# Altium project projekt.PrjPCB
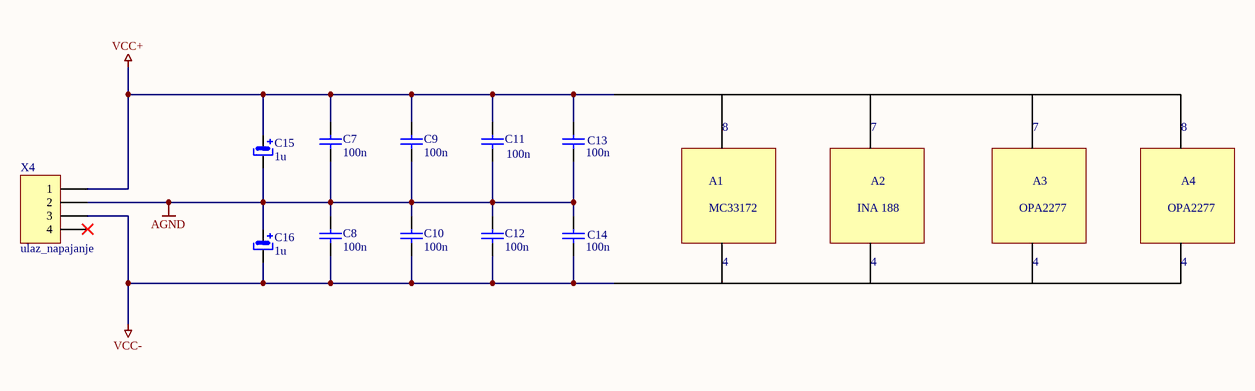
[diagram p0: napajanje.SchDoc]
2 sheets, 45 parts. Net scope: global (net labels, ports and power ports of the same name join across sheets).
Board files: PCB6.PcbDoc, PCB10.PcbDoc
Sheets:
  napajanje.SchDoc
  shema_projekt kor4.SchDoc

## Sheet napajanje.SchDoc
size A4

### Parts
C7  100n  [C0805]
C8  100n  [C0805]
C9  100n  [C0805]
C10  100n  [C0805]
C11  100n  [C0805]
C12  100n  [C0805]
C13  100n  [C0805]
C14  100n  [C0805]
C15  1u  [6-0805_M]
C16  1u  [6-0805_M]
X4  ulaz_napajanje  [HDR1X4]

### Nets
AGND: C7.1 C8.2 C9.1 C10.2 C11.1 C12.2 C13.1 C14.2 C15.2 C16.1 X4.2
VCC+: C7.2 C9.2 C11.2 C13.2 C15.1 X4.1
VCC-: C8.1 C10.1 C12.1 C14.1 C16.2 X4.3

Not connected (* = marked no-connect by the designer): X4 4*

### Notes on the sheet
- 8
- 7
- A1
- MC33172
- INA 188
- A2
- OPA2277
- A3
- A4
- 4

### Library data of the parts
C7-C14 = Cap: Capacitor; Value: 100pF; cijena [£]: 0.146; Kat.broj: 1301717; Published: 8-Jun-2000; LatestRevisionDate: 17-Jul-2002; LatestRevisionNote: Re-released for DXP Platform.; PackageReference: RAD-0.3; Publisher: Altium Limited; PackageDescription: Radial Cap, Thru-Hole; 2 Leads; 0.3 in Pin Spacing
C15 C16 = elko: cijena [£]: 0.521; Kat.broj: 1658221
X4 = Header 4H: Header, 4-Pin, Right Angle; cijena [£]: 1.38; Kat.broj: 2554950; LatestRevisionDate: 17-Jul-2002; LatestRevisionNote: Re-released for DXP Platform.; Publisher: Altium Limited

## Sheet shema_projekt kor4.SchDoc
size A4
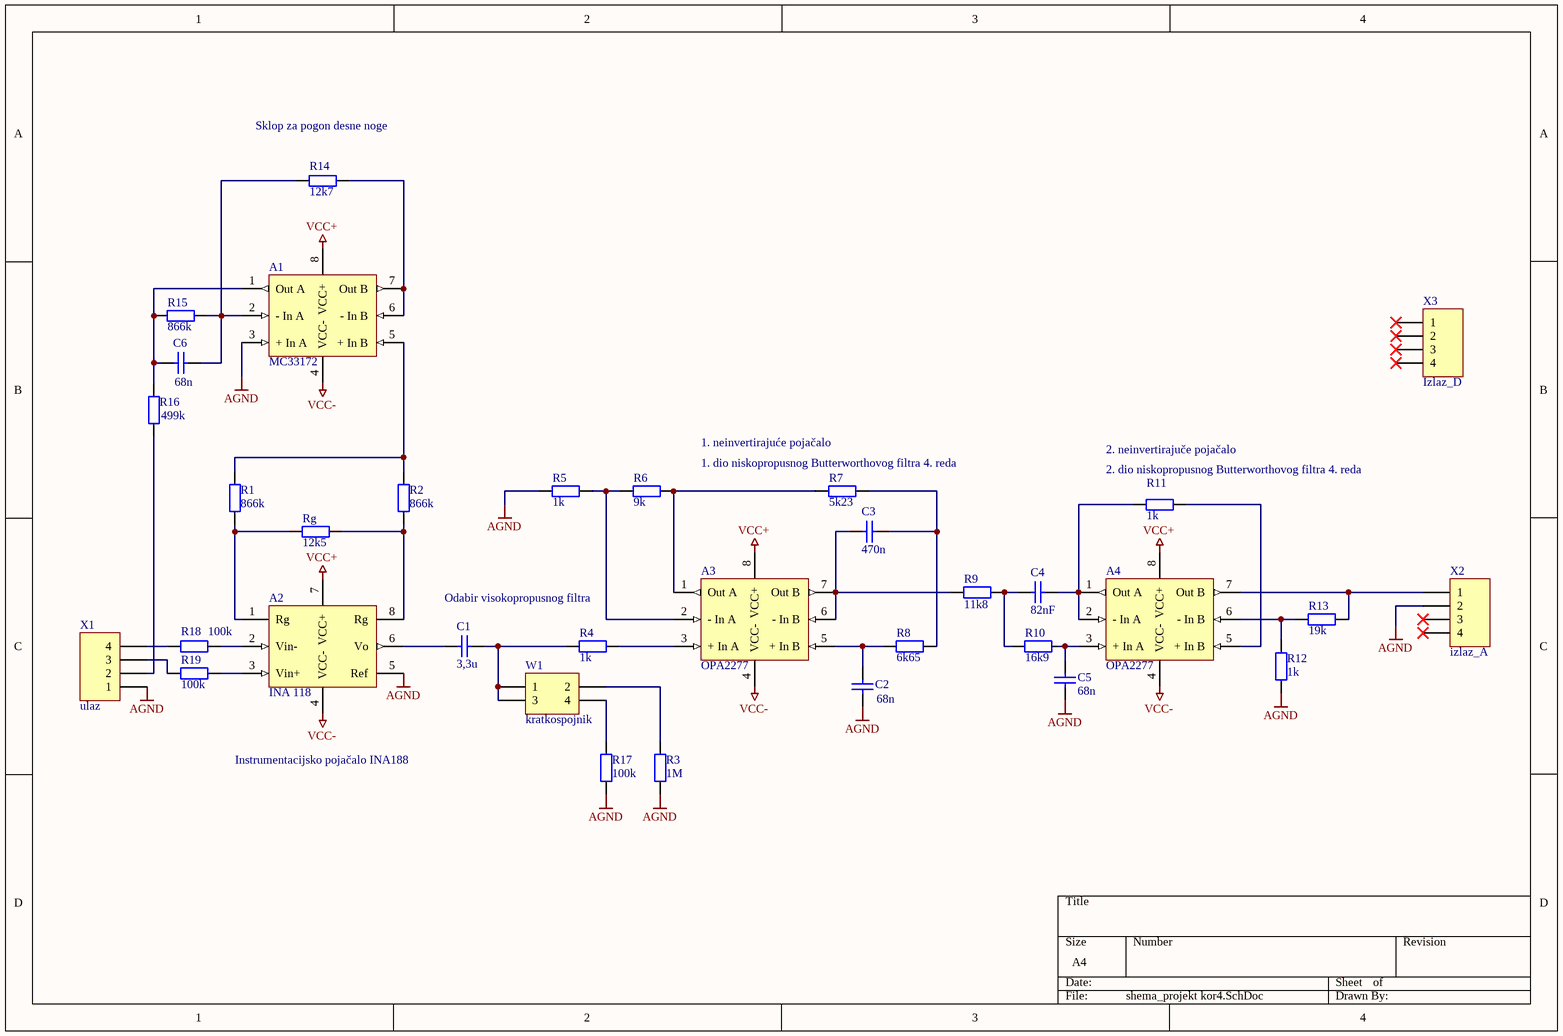
[diagram p1: shema_projekt kor4.SchDoc]

### Parts
A1  MC33172  [SOIC127P600X175-8N]
A2  INA 118  [SOIC127P600X175-8N]
A3  OPA2277  [SOIC127P600X175-8N]
A4  OPA2277  [SOIC127P600X175-8N]
C1  3,3u  [C0805]
C2  68n  [C0805]
C3  470n  [C0805]
C4  82nF  [C0805]
C5  68n  [C0805]
C6  68n  [C0805]
R1  866k  [C0805]
R2  866k  [C0805]
R3  1M  [C0805]
R4  1k  [C0805]
R5  1k  [C0805]
R6  9k  [C0805]
R7  5k23  [C0805]
R8  6k65  [C0805]
R9  11k8  [C0805]
R10  16k9  [C0805]
R11  1k  [C0805]
R12  1k  [C0805]
R13  19k  [C0805]
R14  12k7  [C0805]
R15  866k  [C0805]
R16  499k  [C0805]
R17  100k  [C0805]
R18  100k  [C0805]
R19  100k  [C0805]
Rg  12k5  [C0805]
W1  kratkospojnik  [HDR2X2]
X1  ulaz  [HDR1X4]
X2  izlaz_A  [HDR1X4]
X3  Izlaz_D  [HDR1X4]

### Nets
AGND: A1.3(+_In_A) A2.5(Ref) C2.2 C5.2 R3.2 R5.1 R12.2 R17.2 X1.1 X2.2
VCC+: A1.8(VCC+) A2.7(VCC+) A3.8(VCC+) A4.8(VCC+)
VCC-: A1.4(VCC-) A2.4(VCC-) A3.4(VCC-) A4.4(VCC-)
NetA1_1: A1.1(Out_A) C6.1 R15.1 R16.1
NetA1_2: A1.2(-_In_A) C6.2 R14.1 R15.2
NetA1_5: A1.5(+_In_B) R1.1 R2.2
NetA1_6: A1.6(-_In_B) A1.7(Out_B) R14.2
NetA2_1: A2.1(Rg) R1.2 Rg.1
NetA2_2: A2.2(Vin-) R18.1
NetA2_3: A2.3(Vin+) R19.2
NetA2_6: A2.6(Vo) C1.1
NetA2_8: A2.8(Rg) R2.1 Rg.2
NetA3_1: A3.1(Out_A) R6.2 R7.1
NetA3_2: A3.2(-_In_A) R5.2 R6.1
NetA3_3: A3.3(+_In_A) R4.2
NetA3_5: A3.5(+_In_B) C2.1 R8.1
NetA3_6: A3.6(-_In_B) A3.7(Out_B) C3.1 R9.2
NetA4_1: A4.1(Out_A) A4.2(-_In_A) C4.2 R11.1
NetA4_3: A4.3(+_In_A) C5.1 R10.2
NetA4_5: A4.5(+_In_B) R11.2
NetA4_6: A4.6(-_In_B) R12.1 R13.1
NetA4_7: A4.7(Out_B) R13.2 X2.1
NetC1_2: C1.2 R4.1 W1.1 W1.3
NetC3_2: C3.2 R7.2 R8.2
NetC4_1: C4.1 R9.1 R10.1
NetR3_1: R3.1 W1.2
NetR16_2: R16.2 X1.2
NetR17_1: R17.1 W1.4
NetR18_2: R18.2 X1.4
NetR19_1: R19.1 X1.3

Not connected (* = marked no-connect by the designer): X2 3* 4*; X3 1* 2* 3* 4*

### Notes on the sheet
- (near R14) Sklop za pogon desne noge
- 1. neinvertirajuće pojačalo
- (near R7) 1. dio niskopropusnog Butterworthovog filtra 4. reda
- (near R11) 2. neinvertirajuče pojačalo
- (near R11) 2. dio niskopropusnog Butterworthovog filtra 4. reda
- Odabir visokopropusnog filtra
- Instrumentacijsko pojačalo INA188

### Library data of the parts
A1 = OPA2333: cijena [£]: 0.864; Kat.broj: 2844927
A2 = INA 333: cijena [£]: 3.64; Kat.broj: 2507235
A3 A4 = OPA2277: cijena [£]: 3.69; Kat.broj: 1234768
C1 = Cap: Capacitor; Value: 100pF; cijena [£]: 0.308; Kat.broj: 1759412; Published: 8-Jun-2000; LatestRevisionDate: 17-Jul-2002; LatestRevisionNote: Re-released for DXP Platform.; PackageReference: RAD-0.3; Publisher: Altium Limited; PackageDescription: Radial Cap, Thru-Hole; 2 Leads; 0.3 in Pin Spacing
C2 C5 C6 = Cap: Capacitor; Value: 100pF; cijena [£]: 0.0442; Kat.broj: 1759262; Published: 8-Jun-2000; LatestRevisionDate: 17-Jul-2002; LatestRevisionNote: Re-released for DXP Platform.; PackageReference: RAD-0.3; Publisher: Altium Limited; PackageDescription: Radial Cap, Thru-Hole; 2 Leads; 0.3 in Pin Spacing
C3 = Cap: Capacitor; Value: 100pF; cijena [£]: 0.112; Kat.broj: 1759148; Published: 8-Jun-2000; LatestRevisionDate: 17-Jul-2002; LatestRevisionNote: Re-released for DXP Platform.; PackageReference: RAD-0.3; Publisher: Altium Limited; PackageDescription: Radial Cap, Thru-Hole; 2 Leads; 0.3 in Pin Spacing
C4 = Cap: Capacitor; Value: 100pF; cijena [£]: 0.0651; Kat.broj: 1759264; Published: 8-Jun-2000; LatestRevisionDate: 17-Jul-2002; LatestRevisionNote: Re-released for DXP Platform.; PackageReference: RAD-0.3; Publisher: Altium Limited; PackageDescription: Radial Cap, Thru-Hole; 2 Leads; 0.3 in Pin Spacing
R1 R2 R15 = Res2: Resistor; Value: 1K; cijena [£]: 0.0081; Kat.broj: 2447731; Published: 8-Jun-2000; LatestRevisionDate: 17-Jul-2002; LatestRevisionNote: Re-released for DXP Platform.; PackageReference: AXIAL-0.4; Publisher: Altium Limited; PackageDescription: Axial Device, Thru-Hole; 2 Leads; 0.4 in Pin Spacing
R3 = Res2: Resistor; Value: 1K; cijena [£]: 0.034; Kat.broj: 1576507; Published: 8-Jun-2000; LatestRevisionDate: 17-Jul-2002; LatestRevisionNote: Re-released for DXP Platform.; PackageReference: AXIAL-0.4; Publisher: Altium Limited; PackageDescription: Axial Device, Thru-Hole; 2 Leads; 0.4 in Pin Spacing
R4 R5 R11 R12 = Res2: Resistor; cijena [£]: 0.0046; Kat.broj: 2688819; Published: 8-Jun-2000; LatestRevisionDate: 17-Jul-2002; LatestRevisionNote: Re-released for DXP Platform.; PackageReference: AXIAL-0.4; Publisher: Altium Limited; PackageDescription: Axial Device, Thru-Hole; 2 Leads; 0.4 in Pin Spacing; Value: 1K
R6 = Res2: Resistor; Value: 1K; cijena [£]: 0.36; Kat.broj: 1160198; Published: 8-Jun-2000; LatestRevisionDate: 17-Jul-2002; LatestRevisionNote: Re-released for DXP Platform.; PackageReference: AXIAL-0.4; Publisher: Altium Limited; PackageDescription: Axial Device, Thru-Hole; 2 Leads; 0.4 in Pin Spacing
R7 = Res2: Resistor; Value: 1K; cijena [£]: 0.0718; Kat.broj: 2312278; Published: 8-Jun-2000; LatestRevisionDate: 17-Jul-2002; LatestRevisionNote: Re-released for DXP Platform.; PackageReference: AXIAL-0.4; Publisher: Altium Limited; PackageDescription: Axial Device, Thru-Hole; 2 Leads; 0.4 in Pin Spacing
R8 = Res2: Resistor; Value: 1K; cijena [£]: 0.0349; Kat.broj: 2138965; Published: 8-Jun-2000; LatestRevisionDate: 17-Jul-2002; LatestRevisionNote: Re-released for DXP Platform.; PackageReference: AXIAL-0.4; Publisher: Altium Limited; PackageDescription: Axial Device, Thru-Hole; 2 Leads; 0.4 in Pin Spacing
R9 = Res2: Resistor; Value: 1K; cijena [£]: 0.0268; Kat.broj: 2138981; Published: 8-Jun-2000; LatestRevisionDate: 17-Jul-2002; LatestRevisionNote: Re-released for DXP Platform.; PackageReference: AXIAL-0.4; Publisher: Altium Limited; PackageDescription: Axial Device, Thru-Hole; 2 Leads; 0.4 in Pin Spacing
R10 = Res2: Resistor; Value: 1K; cijena [£]: 0.026; Kat.broj: 1652926; Published: 8-Jun-2000; LatestRevisionDate: 17-Jul-2002; LatestRevisionNote: Re-released for DXP Platform.; PackageReference: AXIAL-0.4; Publisher: Altium Limited; PackageDescription: Axial Device, Thru-Hole; 2 Leads; 0.4 in Pin Spacing
R13 = Res2: Resistor; Value: 1K; cijena [£]: 0.026; Kat.broj: 1692532; Published: 8-Jun-2000; LatestRevisionDate: 17-Jul-2002; LatestRevisionNote: Re-released for DXP Platform.; PackageReference: AXIAL-0.4; Publisher: Altium Limited; PackageDescription: Axial Device, Thru-Hole; 2 Leads; 0.4 in Pin Spacing
R14 = Res2: Resistor; Value: 1K; cijena [£]: 0.026; Kat.broj: 1469868; Published: 8-Jun-2000; LatestRevisionDate: 17-Jul-2002; LatestRevisionNote: Re-released for DXP Platform.; PackageReference: AXIAL-0.4; Publisher: Altium Limited; PackageDescription: Axial Device, Thru-Hole; 2 Leads; 0.4 in Pin Spacing
R16 = Res2: Resistor; Value: 1K; cijena [£]: 0.0264; Kat.broj: 1653008; Published: 8-Jun-2000; LatestRevisionDate: 17-Jul-2002; LatestRevisionNote: Re-released for DXP Platform.; PackageReference: AXIAL-0.4; Publisher: Altium Limited; PackageDescription: Axial Device, Thru-Hole; 2 Leads; 0.4 in Pin Spacing
R17 = Res2: Resistor; Value: 1K; cijena [£]: 0.0015; Kat.broj: 2446868; Published: 8-Jun-2000; LatestRevisionDate: 17-Jul-2002; LatestRevisionNote: Re-released for DXP Platform.; PackageReference: AXIAL-0.4; Publisher: Altium Limited; PackageDescription: Axial Device, Thru-Hole; 2 Leads; 0.4 in Pin Spacing
R18 R19 = Res2: Resistor; Value: 1K; cijena [£]: 0.0264; Kat.broj: 1469860RL; Published: 8-Jun-2000; LatestRevisionDate: 17-Jul-2002; LatestRevisionNote: Re-released for DXP Platform.; PackageReference: AXIAL-0.4; Publisher: Altium Limited; PackageDescription: Axial Device, Thru-Hole; 2 Leads; 0.4 in Pin Spacing
Rg = Res2: Resistor; Value: 1K; cijena [£]: 0.0138; Kat.broj: 1469867; Published: 8-Jun-2000; LatestRevisionDate: 17-Jul-2002; LatestRevisionNote: Re-released for DXP Platform.; PackageReference: AXIAL-0.4; Publisher: Altium Limited; PackageDescription: Axial Device, Thru-Hole; 2 Leads; 0.4 in Pin Spacing
W1 = Header 2X2: Header, 2-Pin, Dual row; LatestRevisionDate: 17-Jul-2002; LatestRevisionNote: Re-released for DXP Platform.; Publisher: Altium Limited
X1-X3 = Header 4H: as X4 on sheet napajanje; LatestRevisionDate: 17-Jul-2002; LatestRevisionNote: Re-released for DXP Platform.; Publisher: Altium Limited

## Nets that join several sheets
AGND: napajanje (11 pins), shema_projekt kor4 (10 pins)
VCC+: napajanje (6 pins), shema_projekt kor4 (A1.8 A2.7 A3.8 A4.8)
VCC-: napajanje (6 pins), shema_projekt kor4 (A1.4 A2.4 A3.4 A4.4)